# EAGLE design 105_vibrator_Rev109 (EAGLE 9.6.2)
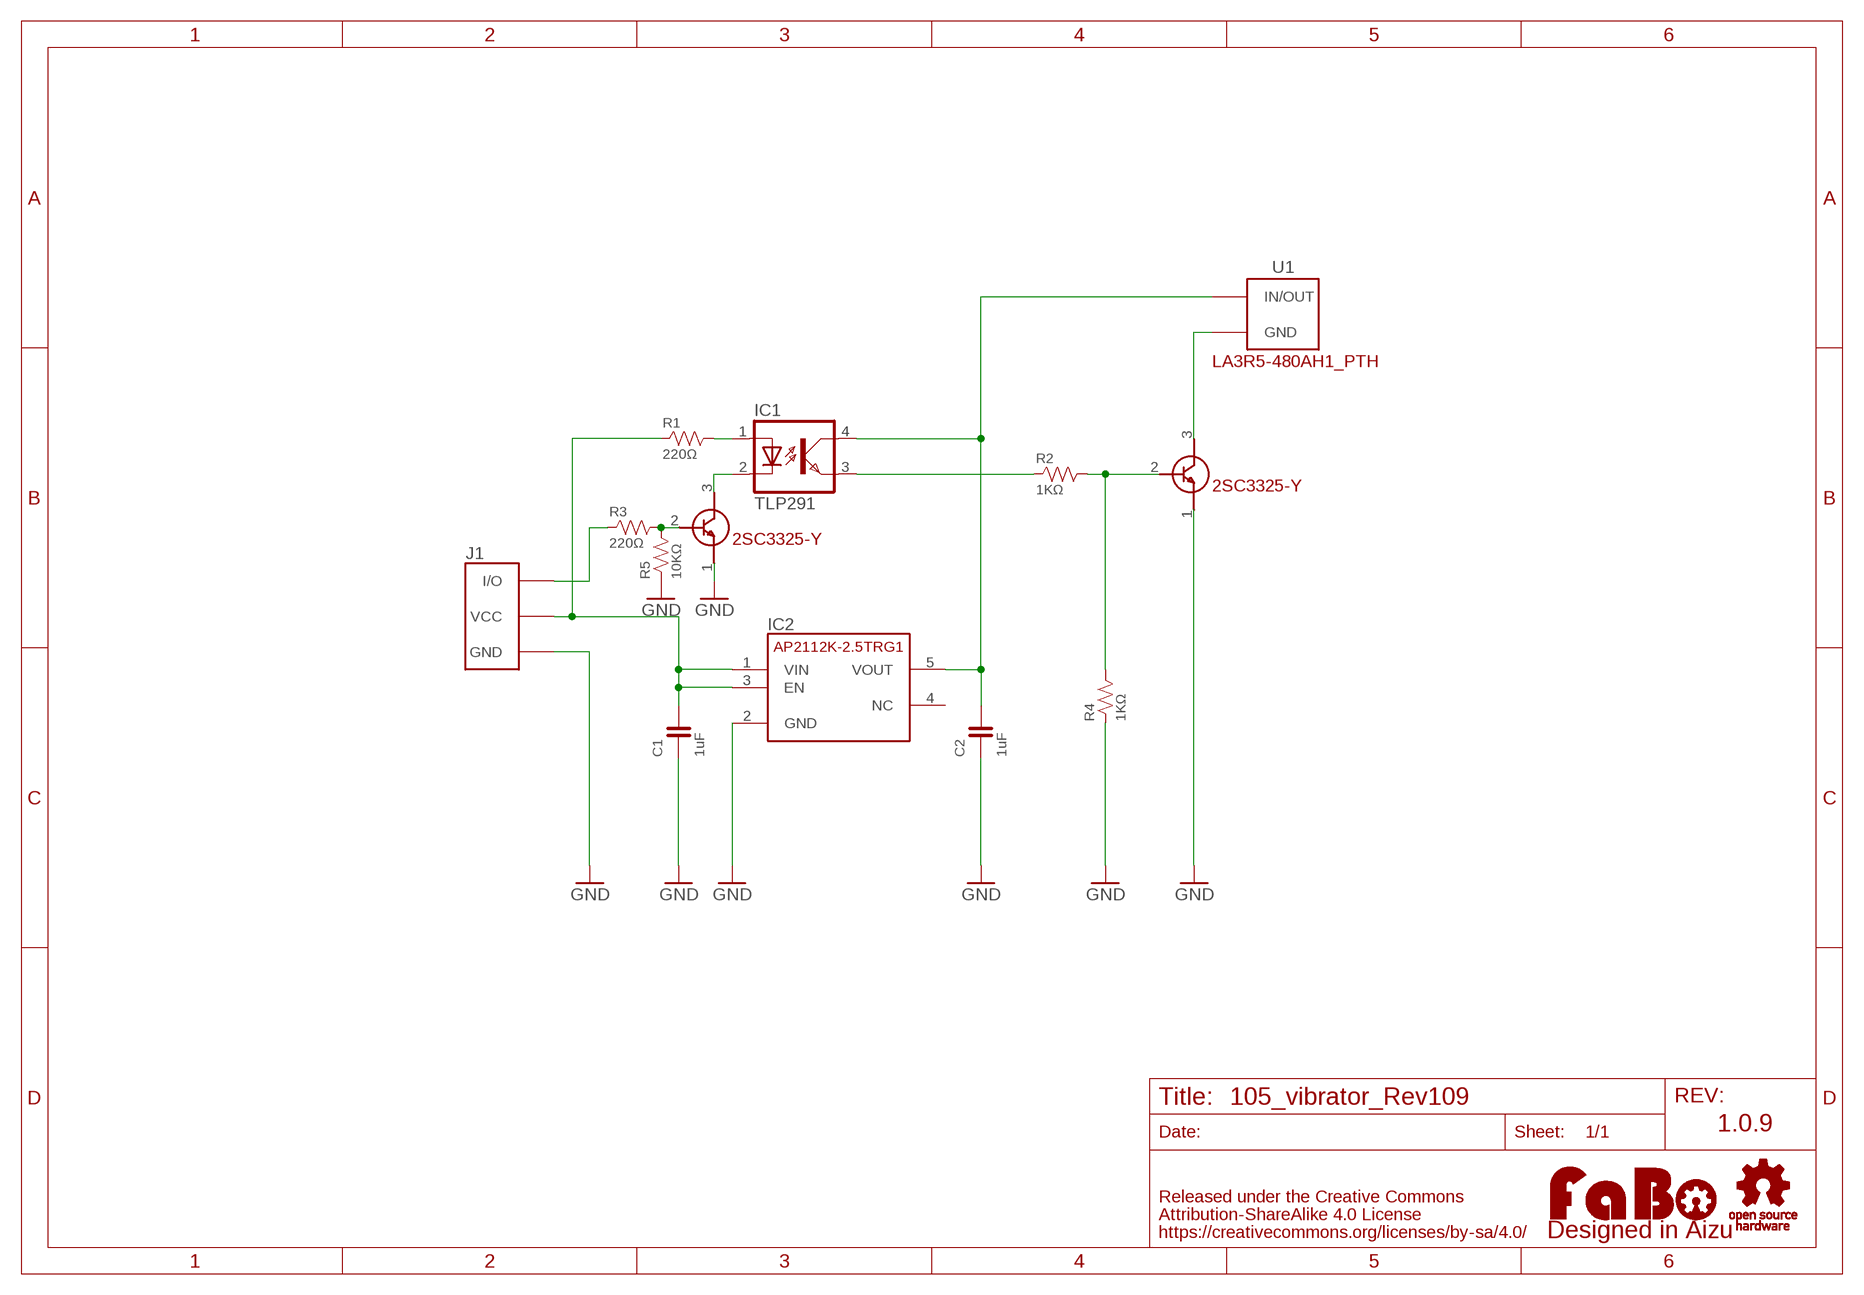
[diagram p0: schematic, sheet 1]

## Parts
C1  1uF  CAPACITOR-0603  [0603]
C2  1uF  CAPACITOR-0603  [0603]
IC1  TLP291  [MINI-FLAT-4]
IC2  AP2112-2.5  [SOT-23-5]
J1  FABO_BRICK_3PIN  [FABO_BRICK_3PIN]
LOGO1  LOGO_FABO-M  [LOGO_FABO_M]
R1  220Ω  RESISTOR-0603  [0603]
R2  1KΩ  RESISTOR-0603  [0603]
R3  220Ω  RESISTOR-0603  [0603]
R4  1KΩ  RESISTOR-0603  [0603]
R5  10KΩ  RESISTOR-0603  [0603]
TR1  2SC3325-Y  [SC-59]
TR2  2SC3325-Y  [SC-59]
U1  VIBRATOR  [LA3R5-480AH1_PTH]
U$2  LOGO_OSHW-M_BOTTOM  [LOGO_OSHW_M_BOTTOM]

## Nets
GND: C1.1 C2.1 IC2.2(GND) J1.GND R4.1 R5.1 TR1.1(E) TR2.1(E)
N$1: IC1.2(C) TR2.3(C)
N$2: IC1.1(A) R1.2
N$4: IC1.3(EMIT) R2.1
N$5: C2.2 IC1.4(COL) IC2.5(VOUT) U1.P$1(IN/OUT)
N$6: J1.I/O R3.1
N$7: TR1.3(C) U1.P$2(GND)
N$8: R2.2 R4.2 TR1.2(B)
N$9: R3.2 R5.2 TR2.2(B)
VCC: C1.2 IC2.1(VIN) IC2.3(EN) J1.VCC R1.1
Unconnected: IC2.4(NC)

## Notes on the sheet
- LA3R5-480AH1_PTH
- 1.0.9

## Library data of the parts
C1 C2 = FaBo-Capacitor:CAPACITOR: CAPACITOR
IC1 = FaBo-Transistor:TLP291
IC2 = FaBo-Supply:AP2112-2.5
J1 = FaBo-Template:FABO_BRICK_3PIN: FaBo Brick 3pin
LOGO1 = component:LOGO_FABO
R1-R5 = FaBo-Resistors:RESISTOR: RESISTOR
TR1 TR2 = FaBo-Transistor:2SC3325-Y
U1 = FaBo-Parts:VIBRATOR
U$2 = FaBo-etc:LOGO_OSHW

## Board
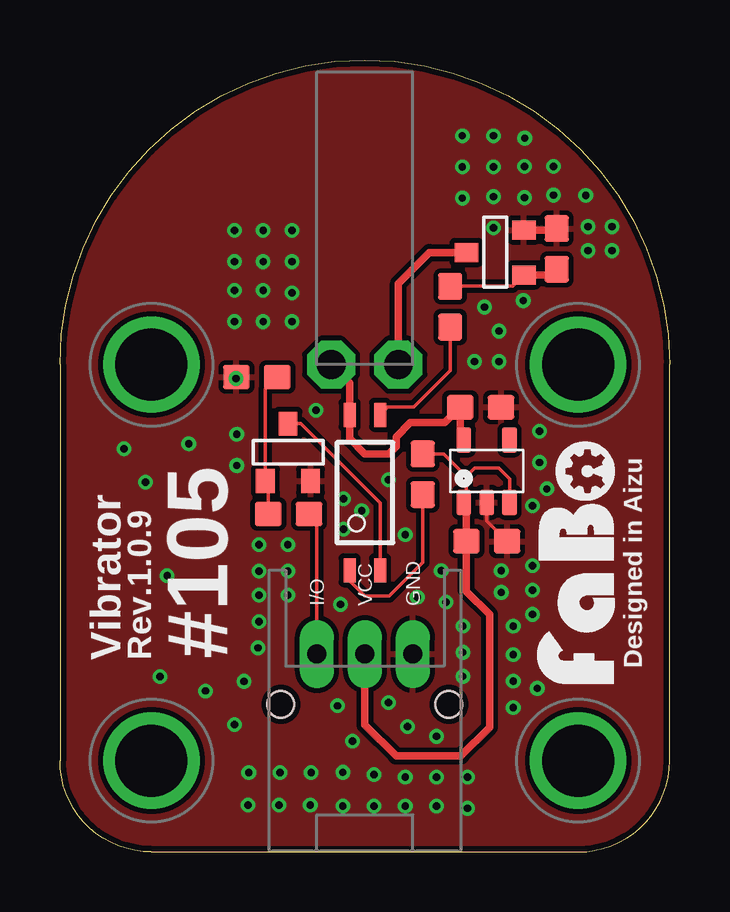
[diagram p1: board, top side]
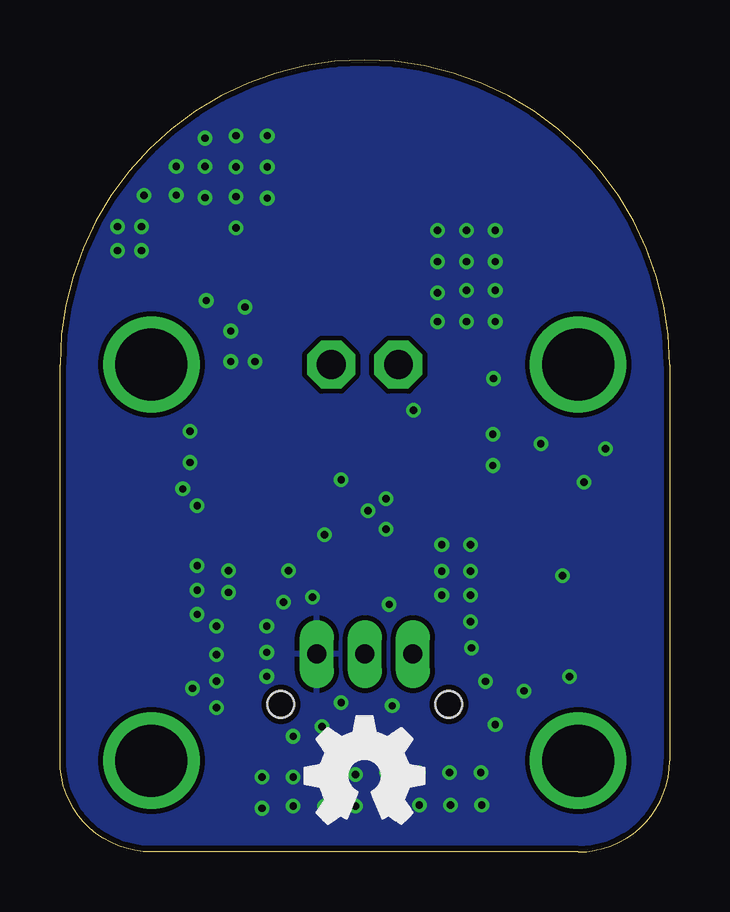
[diagram p2: board, bottom side, seen from below]

Size 25.4 x 33.02 mm. Coordinates in mm from the lower left corner, seen from the top.
Copper layers (1*16): Top 0.035mm / dielectric 1.6mm / Bottom 0.035mm
Design rules "PCBway": minimum track width 6mil, minimum drill 12mil, track to track 6mil, track to pad 6mil, pad to pad 6mil, via to via 6mil, smd to smd 6mil, copper to edge 10mil, drill to drill 10mil, minimum pad ring 10mil, minimum via ring 6mil, stop-mask expansion 2mil, vias tented up to drill 100mil, thermal gap 8mil

### Footprints (pad centres in the part's own frame; a part is rotated, then mirrored left to right if it is on the bottom)
0603 = smd 1.1 x 1: 1 -0.85,0; 2 0.85,0
MINI-FLAT-4 = smd 1 x 0.5: 1 -3.24,0.635; 2 -3.24,-0.635; 3 3.24,-0.635; 4 3.24,0.635
SOT-23-5 = smd 0.6 x 1.05: 1 -0.95,-1.3; 2 0,-1.3; 3 0.95,-1.3; 4 0.95,1.3; 5 -0.95,1.3
FABO_BRICK_3PIN = drill 0.8 pad 1.422 long: GND 2,-8.255; I/O -2,-8.255; VCC 0,-8.255 | drill 3 pad 3.81: P$1 -8.89,3.81; P$2 8.89,3.81; P$3 -8.89,-12.7; P$4 8.89,-12.7 | hole 1.1: -3.5,-10.355; 3.5,-10.355
SC-59 = smd 0.787 x 0.991: 1 -0.914,1.168; 2 0.965,1.168; 3 0.025,-1.219
LA3R5-480AH1_PTH = drill 1.2 pad 2 octagon: P$1 -1.4,0; P$2 1.4,0

### Placement (x,y rotation side)
C1  17.78,12.95 180 top
C2  17.53,18.54 180 top
IC1  12.7,14.99 90 top
IC2  17.78,15.88 0 top
J1  12.7,16.51 0 top
LOGO1  23.5,12.06 90 top
R1  15.11,15.75 270 top
R2  16.26,22.73 90 top
R3  9.53,14.1 180 top
R4  20.7,25.15 270 top
R5  8.2,19.8 0 top
TR1  18.16,25.02 270 top
TR2  9.53,16.64 180 top
U1  12.7,20.32 0 top
U$2  12.7,3.17 0 top

### Tracks (layer width: path | path; a pad name or v marks a point on that pad's centre or on a via)
GND  (via drill 0.3)
  Top 0.152: C1.1 17.78,13.8 IC2.2
  Top 0.305: TR1.1 20.64,25.93 R4.1
  other vias: 18.29,20.45 8.29,9.61 11.56,6.1 8.26,8.51 11.81,14.73 11.81,13.46 12.57,14.22 19.68,11.94 19.68,10.92 19.68,9.91 17.27,20.45 18.29,21.72 19.3,22.99 7.34,19.74 7.83,1.95 18.06,28.56 19.36,28.58 21.91,27.37 18.06,27.32 7.37,17.41 7.37,16.11 10.67,18.41 20.56,28.58 19.36,27.28 20.56,27.38 22.01,26.07 8.29,10.71 8.29,11.71 9.49,11.71 9.49,10.71 8.29,12.81 9.49,12.81 18.06,26.02 18.06,29.86 19.36,29.76 17.69,22.72 23.01,26.07 22.01,25.07 23.01,25.07 18.39,11.72 18.39,10.82 16.09,10.42 16.79,9.42 16.79,8.32 18.89,9.42 18.89,8.22 13.69,6.22 14.48,5.22 15.69,4.82 14.38,13.22 13.69,15.52 11.69,10.32 12.19,4.62 11.79,3.32 13.09,3.22 11.79,1.92 13.09,1.92 14.38,3.12 15.69,3.12 16.98,3.12 14.38,1.92 15.69,1.92 16.98,1.82 18.89,7.12 18.89,6.02 19.89,6.82 16.79,7.32 14.88,10.62 15.88,11.72 19.68,14.44 19.98,17.54 19.98,16.24 20.29,15.14 7.27,22.11 8.47,22.11 9.67,22.11 7.27,23.41 8.47,23.41 9.67,23.32 7.27,24.61 8.47,24.61 9.67,24.61 2.67,16.82 3.57,15.41 5.37,17.02 4.47,11.52 7.87,3.31 9.17,3.31 10.47,3.31 7.27,25.91 8.47,25.91 9.67,25.91 16.76,29.86 16.76,28.56 16.76,27.26 10.43,1.95 4.17,7.32 9.13,1.95 6.07,6.71 7.27,5.32 7.67,7.12
  pour Bottom (isolate 0.203): 0,0 25.4,0 25.4,33.02 0,33.02
  pour Top (isolate 0.203): 0,0 25.4,0 25.4,33.02 0,33.02
N$1
  Top 0.152: IC1.2 13.34,14.56 10.04,17.86 TR2.3
N$2
  Top 0.152: IC1.1 12.06,11.3 12.7,10.67 13.72,10.67 15.11,12.06 R1.2
N$4
  Top 0.152: IC1.3 13.65,18.54 14.73,18.54 16.26,20.07 R2.1
N$5
  Top 0.203: IC1.4 12.06,18.3
  Top 0.305: IC2.5 16.68,17.33 C2.2 16.03,17.9 14.6,17.9 14,17.3 14,16.9 13.7,16.6 12.7,16.6 12.06,17.23 12.06,18.3 | U1.P$1 12.06,19.55 IC1.4
N$6
  Top 0.152: J1.I/O 10.7,13.77 R3.1
N$7
  Top 0.305: U1.P$2 14.1,23.7 15.39,24.99 TR1.3
N$8
  Top 0.152: R2.2 18.86,23.58 TR1.2
  Top 0.305: TR1.2 20.46,24.05 R4.2
N$9
  Top 0.152: R3.2 8.68,15.35 TR2.2 8.56,19.31 R5.2
VCC
  Top 0.152: IC2.1 16.93,14.47 16.93,15.66 | IC2.3 18.73,15.56 18.29,16 17.27,16 16.93,15.66 | R1.1 15.99,16.6 16.93,15.66
  Top 0.305: J1.VCC 12.7,5.3 14,4 16.7,4 17.9,5.2 17.9,9.9 16.93,10.87 C1.2 16.93,14.47

### Text on the board
tPlace: #105 | Designed in Aizu | Vibrator | Rev.1.0.9